# EAGLE design mux16_board (EAGLE 9.6.2)
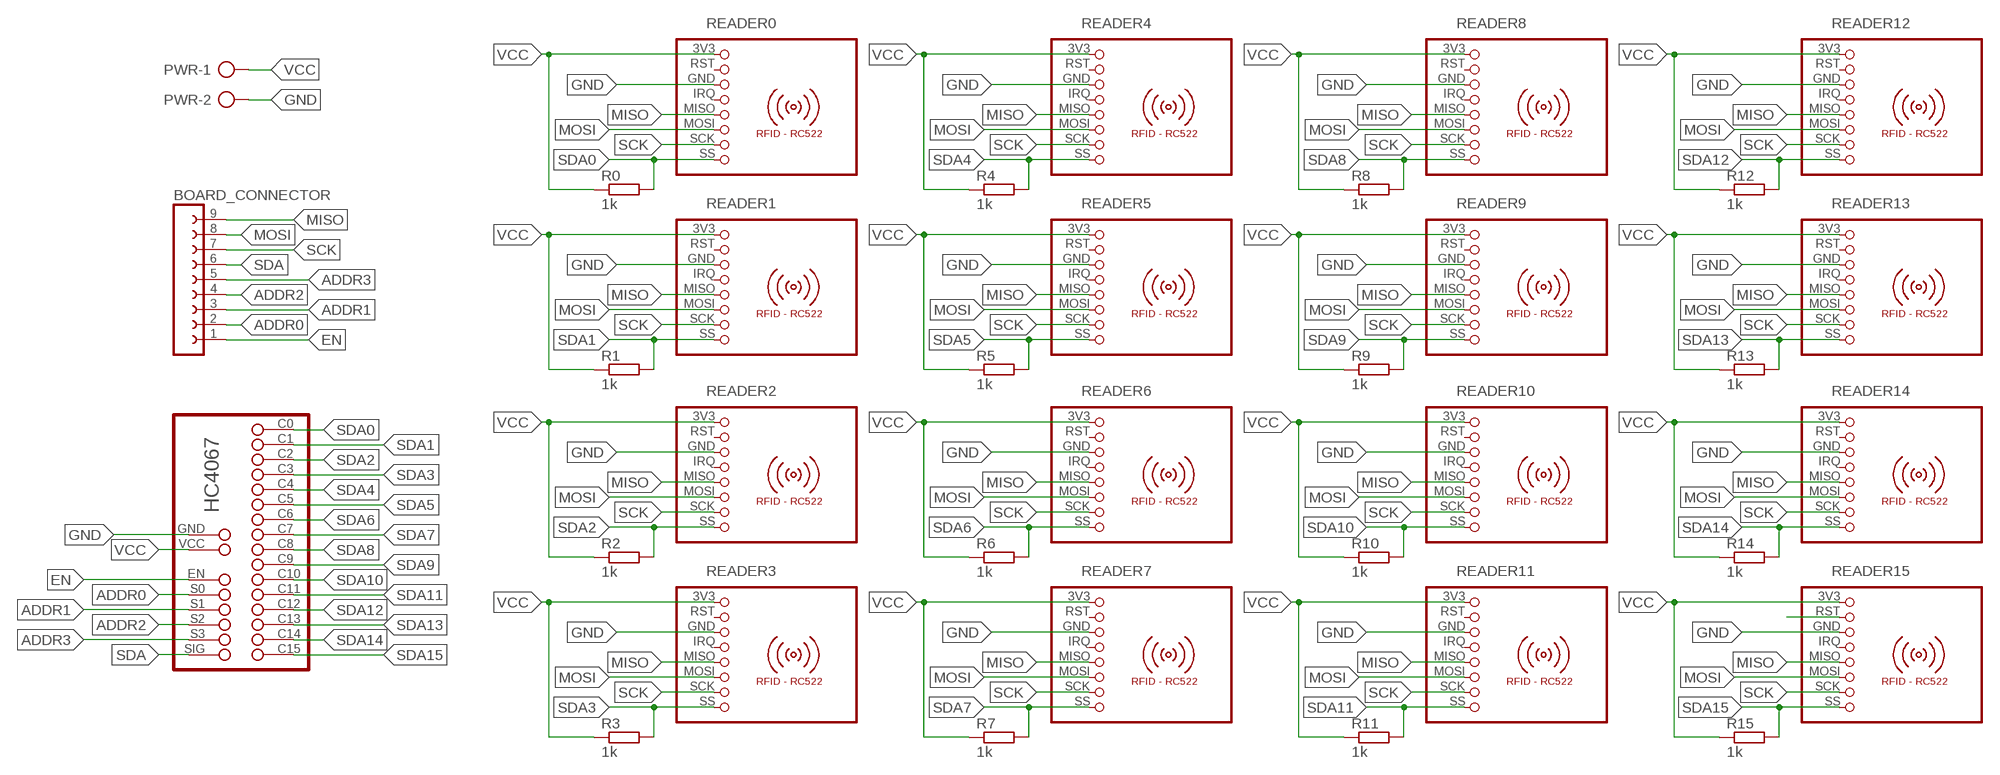
[diagram p0: schematic, sheet 1]

## Parts
BOARD_CONNECTOR  FE09-1  [FE09]
PWR  AK500/2  [AK500/2]
R0  1k  R-EU_0207/10  [0207/10]
R1  1k  R-EU_0207/10  [0207/10]
R2  1k  R-EU_0207/10  [0207/10]
R3  1k  R-EU_0207/10  [0207/10]
R4  1k  R-EU_0207/10  [0207/10]
R5  1k  R-EU_0207/10  [0207/10]
R6  1k  R-EU_0207/10  [0207/10]
R7  1k  R-EU_0207/10  [0207/10]
R8  1k  R-EU_0207/10  [0207/10]
R9  1k  R-EU_0207/10  [0207/10]
R10  1k  R-EU_0207/10  [0207/10]
R11  1k  R-EU_0207/10  [0207/10]
R12  1k  R-EU_0207/10  [0207/10]
R13  1k  R-EU_0207/10  [0207/10]
R14  1k  R-EU_0207/10  [0207/10]
R15  1k  R-EU_0207/10  [0207/10]
READER0  RFID-RC522  [RFID-RC522]
READER1  RFID-RC522  [RFID-RC522]
READER2  RFID-RC522  [RFID-RC522]
READER3  RFID-RC522  [RFID-RC522]
READER4  RFID-RC522  [RFID-RC522]
READER5  RFID-RC522  [RFID-RC522]
READER6  RFID-RC522  [RFID-RC522]
READER7  RFID-RC522  [RFID-RC522]
READER8  RFID-RC522  [RFID-RC522]
READER9  RFID-RC522  [RFID-RC522]
READER10  RFID-RC522  [RFID-RC522]
READER11  RFID-RC522  [RFID-RC522]
READER12  RFID-RC522  [RFID-RC522]
READER13  RFID-RC522  [RFID-RC522]
READER14  RFID-RC522  [RFID-RC522]
READER15  RFID-RC522  [RFID-RC522]
U$1  HC4067_BREAKOUT_BOARD  [ANALOG_MUX_BREAKOUT_HC4067]

## Nets
ADDR0: BOARD_CONNECTOR.2 U$1.S0
ADDR1: BOARD_CONNECTOR.3 U$1.S1
ADDR2: BOARD_CONNECTOR.4 U$1.S2
ADDR3: BOARD_CONNECTOR.5 U$1.S3
EN: BOARD_CONNECTOR.1 U$1.EN
GND: PWR.2 READER0.GND READER1.GND READER2.GND READER3.GND READER4.GND READER5.GND READER6.GND READER7.GND READER8.GND READER9.GND READER10.GND READER11.GND READER12.GND READER13.GND READER14.GND READER15.GND U$1.GND
MISO: BOARD_CONNECTOR.9 READER0.MISO READER1.MISO READER2.MISO READER3.MISO READER4.MISO READER5.MISO READER6.MISO READER7.MISO READER8.MISO READER9.MISO READER10.MISO READER11.MISO READER12.MISO READER13.MISO READER14.MISO READER15.MISO
MOSI: BOARD_CONNECTOR.8 READER0.MOSI READER1.MOSI READER2.MOSI READER3.MOSI READER4.MOSI READER5.MOSI READER6.MOSI READER7.MOSI READER8.MOSI READER9.MOSI READER10.MOSI READER11.MOSI READER12.MOSI READER13.MOSI READER14.MOSI READER15.MOSI
RST: READER15.RST
SCK: BOARD_CONNECTOR.7 READER0.SCK READER1.SCK READER2.SCK READER3.SCK READER4.SCK READER5.SCK READER6.SCK READER7.SCK READER8.SCK READER9.SCK READER10.SCK READER11.SCK READER12.SCK READER13.SCK READER14.SCK READER15.SCK
SDA: BOARD_CONNECTOR.6 U$1.SIG
SDA0: R0.2 READER0.SS U$1.C0
SDA1: R1.2 READER1.SS U$1.C1
SDA2: R2.2 READER2.SS U$1.C2
SDA3: R3.2 READER3.SS U$1.C3
SDA4: R4.2 READER4.SS U$1.C4
SDA5: R5.2 READER5.SS U$1.C5
SDA6: R6.2 READER6.SS U$1.C6
SDA7: R7.2 READER7.SS U$1.C7
SDA8: R8.2 READER8.SS U$1.C8
SDA9: R9.2 READER9.SS U$1.C9
SDA10: R10.2 READER10.SS U$1.C10
SDA11: R11.2 READER11.SS U$1.C11
SDA12: R12.2 READER12.SS U$1.C12
SDA13: R13.2 READER13.SS U$1.C13
SDA14: R14.2 READER14.SS U$1.C14
SDA15: R15.2 READER15.SS U$1.C15
VCC: PWR.1 R0.1 R1.1 R2.1 R3.1 R4.1 R5.1 R6.1 R7.1 R8.1 R9.1 R10.1 R11.1 R12.1 R13.1 R14.1 R15.1 READER0.3V3 READER1.3V3 READER2.3V3 READER3.3V3 READER4.3V3 READER5.3V3 READER6.3V3 READER7.3V3 READER8.3V3 READER9.3V3 READER10.3V3 READER11.3V3 READER12.3V3 READER13.3V3 READER14.3V3 READER15.3V3 U$1.VCC
Unconnected: READER0.IRQ READER0.RST READER1.IRQ READER1.RST READER2.IRQ READER2.RST READER3.IRQ READER3.RST READER4.IRQ READER4.RST READER5.IRQ READER5.RST READER6.IRQ READER6.RST READER7.IRQ READER7.RST READER8.IRQ READER8.RST READER9.IRQ READER9.RST READER10.IRQ READER10.RST READER11.IRQ READER11.RST READER12.IRQ READER12.RST READER13.IRQ READER13.RST READER14.IRQ READER14.RST READER15.IRQ

## Library data of the parts
BOARD_CONNECTOR = con-lsta:FE09-1: FEMALE HEADER; OC_FARNELL: unknown; OC_NEWARK: unknown
PWR = con-ptr500:AK500/2: CONNECTOR; OC_FARNELL: unknown; OC_NEWARK: unknown
R0 R1-R15 = rcl:R-EU_: RESISTOR, European symbol; SPICEPREFIX: R
READER0 READER1-READER15 = mfrc522-module:RFID-RC522: RFID-RC522 MFRC-522 based breakout board
U$1 = HC4067_breakout_board:HC4067_BREAKOUT_BOARD

## Board
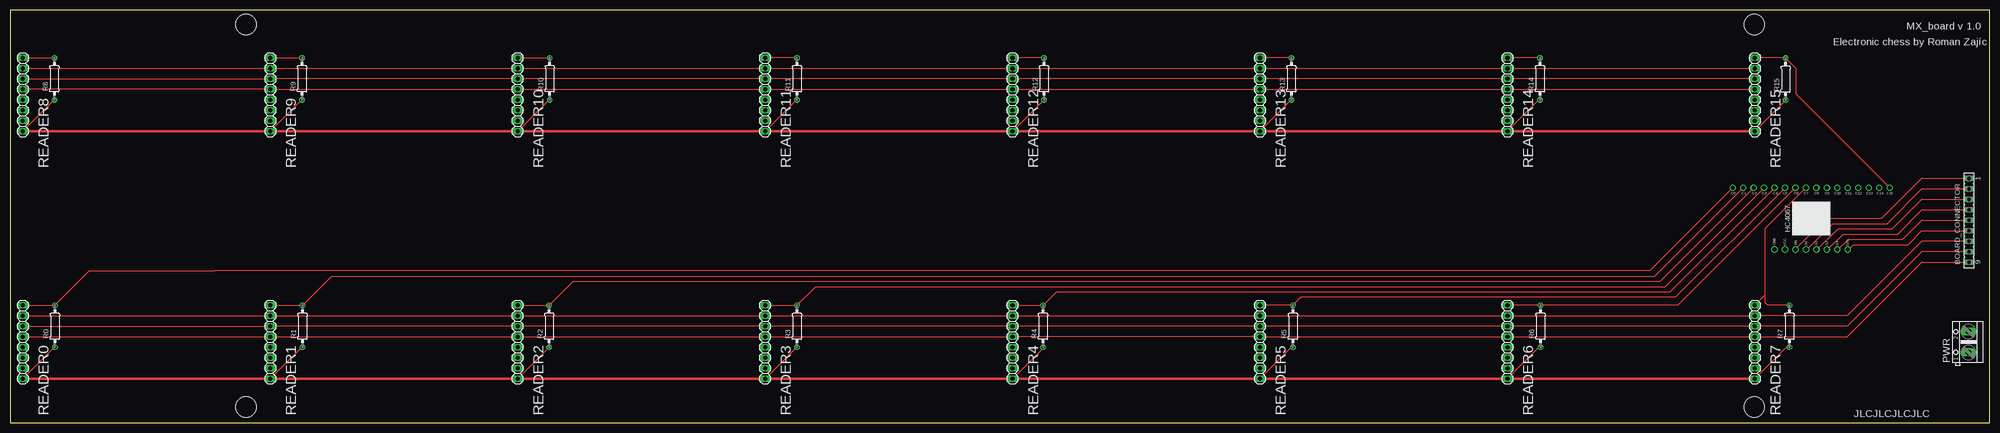
[diagram p1: board, top side]
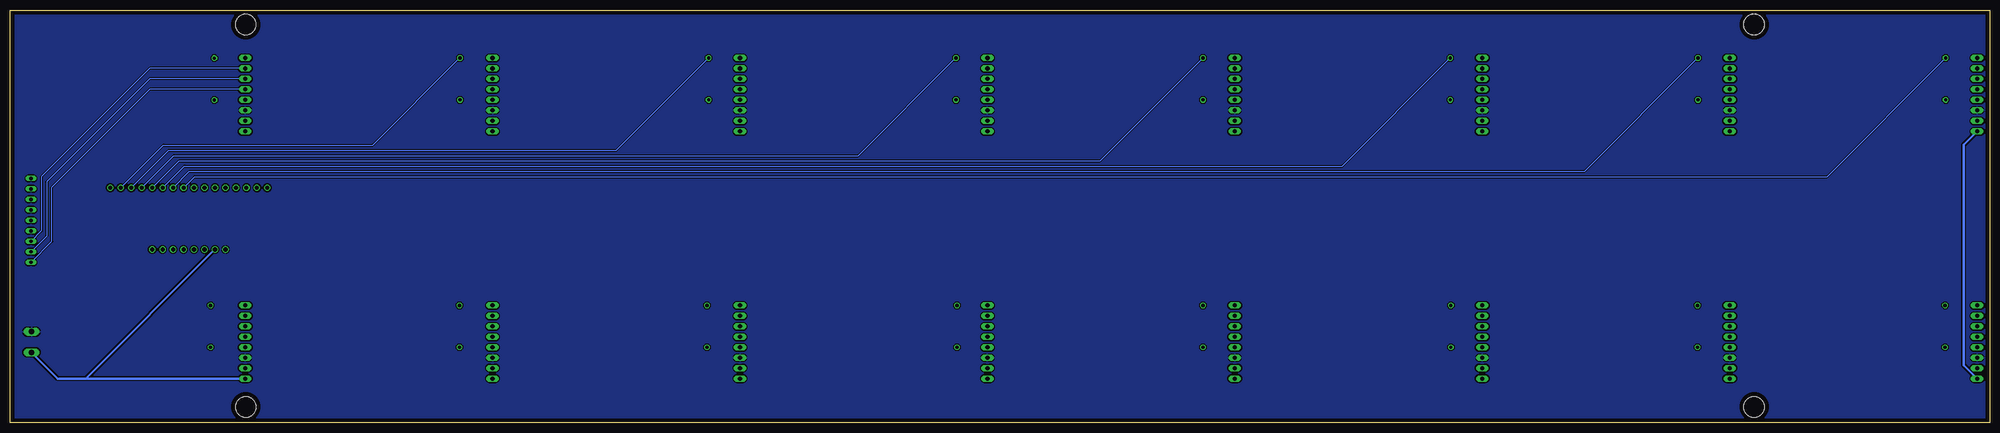
[diagram p2: board, bottom side, seen from below]

Size 480 x 100 mm. Coordinates in mm from the lower left corner, seen from the top.
Outline: 0,0 480,0 480,100 0,100 0,0
Copper layers (1*16): Top 0.035mm / dielectric 1.5mm / Bottom 0.035mm
Design rules "default *": minimum track width 6mil, minimum drill 0.35mm, track to track 12mil, track to pad 6mil, pad to pad 6mil, via to via 6mil, smd to smd 6mil, copper to edge 40mil, drill to drill 6mil, minimum pad ring 10mil, minimum via ring 8mil, stop-mask expansion 4mil, vias tented up to drill 0mil, thermal gap 10mil
Holes 5 mm at 57.15,3.81 57.15,96.52 422.91,96.52 422.91,3.81

### Footprints (pad centres in the part's own frame; a part is rotated, then mirrored left to right if it is on the bottom)
FE09 = drill 0.813 long: 1 -10.16,0; 2 -7.62,0; 3 -5.08,0; 4 -2.54,0; 5 0,0; 6 2.54,0; 7 5.08,0; 8 7.62,0; 9 10.16,0
AK500/2 = drill 1.321 long: 1 -2.515,0; 2 2.515,0
0207/10 = drill 0.813 octagon: 1 -5.08,0; 2 5.08,0
RFID-RC522 = drill 1.016 long: 3V3 10.668,-3.048; GND 15.748,-3.048; IRQ 18.288,-3.048; MISO 20.828,-3.048; MOSI 23.368,-3.048; RST 13.208,-3.048; SCK 25.908,-3.048; SS 28.448,-3.048
ANALOG_MUX_BREAKOUT_HC4067 = drill 1: C0 19.05,-7.493; C1 16.51,-7.493; C2 13.97,-7.493; C3 11.43,-7.493; C4 8.89,-7.493; C5 6.35,-7.493; C6 3.81,-7.493; C7 1.27,-7.493; C8 -1.27,-7.493; C9 -3.81,-7.493; C10 -6.35,-7.493; C11 -8.89,-7.493; C12 -11.43,-7.493; C13 -13.97,-7.493; C14 -16.51,-7.493; C15 -19.05,-7.493; EN 3.81,7.493; GND 8.89,7.493; S0 1.27,7.493; S1 -1.27,7.493; S2 -3.81,7.493; S3 -6.35,7.493; SIG -8.89,7.493; VCC 6.35,7.493

### Placement (x,y rotation side)
BOARD_CONNECTOR  474.98,49.06 270 top
PWR  474.85,19.56 90 top
R0  10.79,23.37 90 top
R1  70.87,23.37 90 top
R2  130.68,23.37 90 top
R3  190.75,23.37 90 top
R4  250.44,23.37 90 top
R5  311.02,23.37 90 top
R6  371.09,23.37 90 top
R7  431.42,23.37 90 top
R8  10.67,83.38 90 top
R9  70.74,83.38 90 top
R10  130.81,83.38 90 top
R11  190.75,83.38 90 top
R12  250.7,83.38 90 top
R13  310.64,83.38 90 top
R14  370.97,83.38 90 top
R15  430.53,83.31 90 top
READER0  0,0 90 top
READER1  60,0 90 top
READER2  120,0 90 top
READER3  180,0 90 top
READER4  240,0 90 top
READER5  300,0 90 top
READER6  360,0 90 top
READER7  420,0 90 top
READER8  0,60 90 top
READER9  60,60 90 top
READER10  120,60 90 top
READER11  180,60 90 top
READER12  240,60 90 top
READER13  300,60 90 top
READER14  360,60 90 top
READER15  420,60 90 top
U$1  436.71,49.49 180 top

### Tracks (layer width: path | path; a pad name or v marks a point on that pad's centre or on a via)
ADDR0
  Top 0.152: U$1.S0 435.7,42 441.96,48.26 455.13,48.26 463.55,56.68 BOARD_CONNECTOR.2
ADDR1
  Top 0.152: U$1.S1 438.24,42 443.23,46.99 456.4,46.99 463.55,54.14 BOARD_CONNECTOR.3
ADDR2
  Top 0.152: U$1.S2 440.78,42 444.5,45.72 457.67,45.72 463.55,51.6 BOARD_CONNECTOR.4
ADDR3
  Top 0.152: U$1.S3 443.32,42 445.77,44.45 458.94,44.45 463.55,49.06 BOARD_CONNECTOR.5
EN
  Top 0.152: U$1.EN 440.44,49.53 453.86,49.53 463.55,59.22 BOARD_CONNECTOR.1
GND
  pour Bottom: -5.08,104.14 -5.08,-6.35 482.6,-6.35 483.87,-5.08 483.87,105.41 481.33,107.95 -1.27,107.95
MISO
  Top 0.152: READER0.MISO READER1.MISO READER2.MISO READER3.MISO READER4.MISO READER5.MISO READER6.MISO READER7.MISO 445.48,20.83 463.55,38.9 BOARD_CONNECTOR.9 | READER8.MISO READER9.MISO READER10.MISO READER11.MISO READER12.MISO READER13.MISO READER14.MISO READER15.MISO
  Bottom 0.152: BOARD_CONNECTOR.9 469.9,43.98 469.9,57.15 446.22,80.83 READER15.MISO
MOSI
  Top 0.152: READER0.MOSI READER1.MOSI READER2.MOSI READER3.MOSI READER4.MOSI READER5.MOSI READER6.MOSI READER7.MOSI 445.48,23.37 463.55,41.44 BOARD_CONNECTOR.8 | READER8.MOSI READER9.MOSI READER10.MOSI READER11.MOSI READER12.MOSI READER13.MOSI READER14.MOSI READER15.MOSI
  Bottom 0.152: BOARD_CONNECTOR.8 471.17,45.25 471.17,58.42 446.22,83.37 READER15.MOSI
SCK
  Top 0.152: READER0.SCK READER1.SCK READER2.SCK READER3.SCK READER4.SCK READER5.SCK READER6.SCK READER7.SCK 445.48,25.91 463.55,43.98 BOARD_CONNECTOR.7 | READER8.SCK READER9.SCK READER10.SCK READER11.SCK READER12.SCK READER13.SCK READER14.SCK READER15.SCK
  Bottom 0.152: BOARD_CONNECTOR.7 472.44,46.52 472.44,59.69 446.22,85.91 READER15.SCK
SDA
  Top 0.152: U$1.SIG 445.86,42 447.04,43.18 460.21,43.18 463.55,46.52 BOARD_CONNECTOR.6
SDA0
  Top 0.152: U$1.C0 397.51,36.83 50.8,36.83 49.53,36.83 19.18,36.83 R0.2 READER0.SS
SDA1
  Top 0.152: U$1.C1 398.78,35.56 77.98,35.56 R1.2 READER1.SS
SDA2
  Top 0.152: U$1.C2 400.05,34.29 136.53,34.29 R2.2 READER2.SS
SDA3
  Top 0.152: U$1.C3 401.32,33.02 195.33,33.02 R3.2 READER3.SS
SDA4
  Top 0.152: U$1.C4 402.59,31.75 253.75,31.75 R4.2 READER4.SS
SDA5
  Top 0.152: U$1.C5 403.86,30.48 313.06,30.48 R5.2 READER5.SS
SDA6
  Top 0.152: U$1.C6 404.37,28.45 R6.2 READER6.SS
SDA7
  Top 0.152: U$1.C7 425.45,46.99 425.45,30.85 | 425.45,30.85 READER7.SS | 425.45,30.85 425.45,29.21 426.21,28.45 R7.2
SDA8
  Top 0.152: READER8.SS 3.06,88.46 R8.2
  Bottom 0.152: U$1.C8 435.28,59.69 39.44,59.69 R8.2
SDA9
  Top 0.152: READER9.SS R9.2
  Bottom 0.152: U$1.C9 436.55,60.96 98.24,60.96 R9.2
SDA10
  Top 0.152: READER10.SS 123.06,88.46 R10.2
  Bottom 0.152: U$1.C10 437.82,62.23 157.04,62.23 R10.2
SDA11
  Top 0.152: R11.2 190.74,88.45 READER11.SS
  Bottom 0.152: U$1.C11 439.09,63.5 215.72,63.5 R11.2
SDA12
  Top 0.152: R12.2 243.06,88.46 READER12.SS
  Bottom 0.152: U$1.C12 440.36,64.77 274.39,64.77 R12.2
SDA13
  Top 0.152: R13.2 303.06,88.46 READER13.SS
  Bottom 0.152: U$1.C13 441.63,66.04 333.06,66.04 R13.2
SDA14
  Top 0.152: R14.2 363.06,88.46 READER14.SS
  Bottom 0.152: U$1.C14 442.9,67.31 392.12,67.31 R14.2
SDA15
  Top 0.152: READER15.SS 430.47,88.45 R15.2 433.07,85.85 433.07,79.68 U$1.C15
VCC
  Top 0.152: READER6.3V3 370.67,18.29 R6.1 | READER7.3V3 430.67,18.29 R7.1 | READER5.3V3 310.67,18.29 R5.1 | READER4.3V3 250.44,18.06 R4.1 | READER3.3V3 190.67,18.29 R3.1 | READER2.3V3 130.67,18.29 R2.1 | READER1.3V3 70.67,18.29 R1.1 | READER0.3V3 10.67,18.29 R0.1 | READER8.3V3 10.67,78.29 R8.1 | READER9.3V3 70.68,78.3 R9.1 | READER10.3V3 130.68,78.3 R10.1 | READER11.3V3 190.68,78.3 R11.1 | READER12.3V3 250.68,78.3 R12.1 | READER13.3V3 310.64,78.26 R13.1 | 363.36,70.98 370.68,78.3 R14.1 | 423.2,70.83 430.53,78.15 R15.1
  Top 0.305: READER9.3V3 READER10.3V3 123.19,70.67 READER11.3V3
  Top 0.61: READER7.3V3 READER6.3V3 READER5.3V3 READER4.3V3 READER3.3V3 READER2.3V3 READER1.3V3 READER0.3V3 | READER8.3V3 READER9.3V3 123.19,70.67 | READER10.3V3 READER11.3V3 READER12.3V3 READER13.3V3 READER14.3V3 | READER14.3V3 363.36,70.98 | READER14.3V3 READER15.3V3 423.2,70.83
  Bottom 0.305: 474.65,16.84 PWR.1
  Bottom 0.61: U$1.VCC 461.69,10.67 | 461.69,10.67 468.48,10.67 474.65,16.84 | READER7.3V3 461.69,10.67 | READER0.3V3 6.35,13.97 6.35,67.37 READER8.3V3

### Text on the board
tPlace: JLCJLCJLCJLC
tNames: MX_board v 1.0 | Electronic chess by Roman Zajíc